# Altium project bailey.PrjPcb (part 3 of 11)
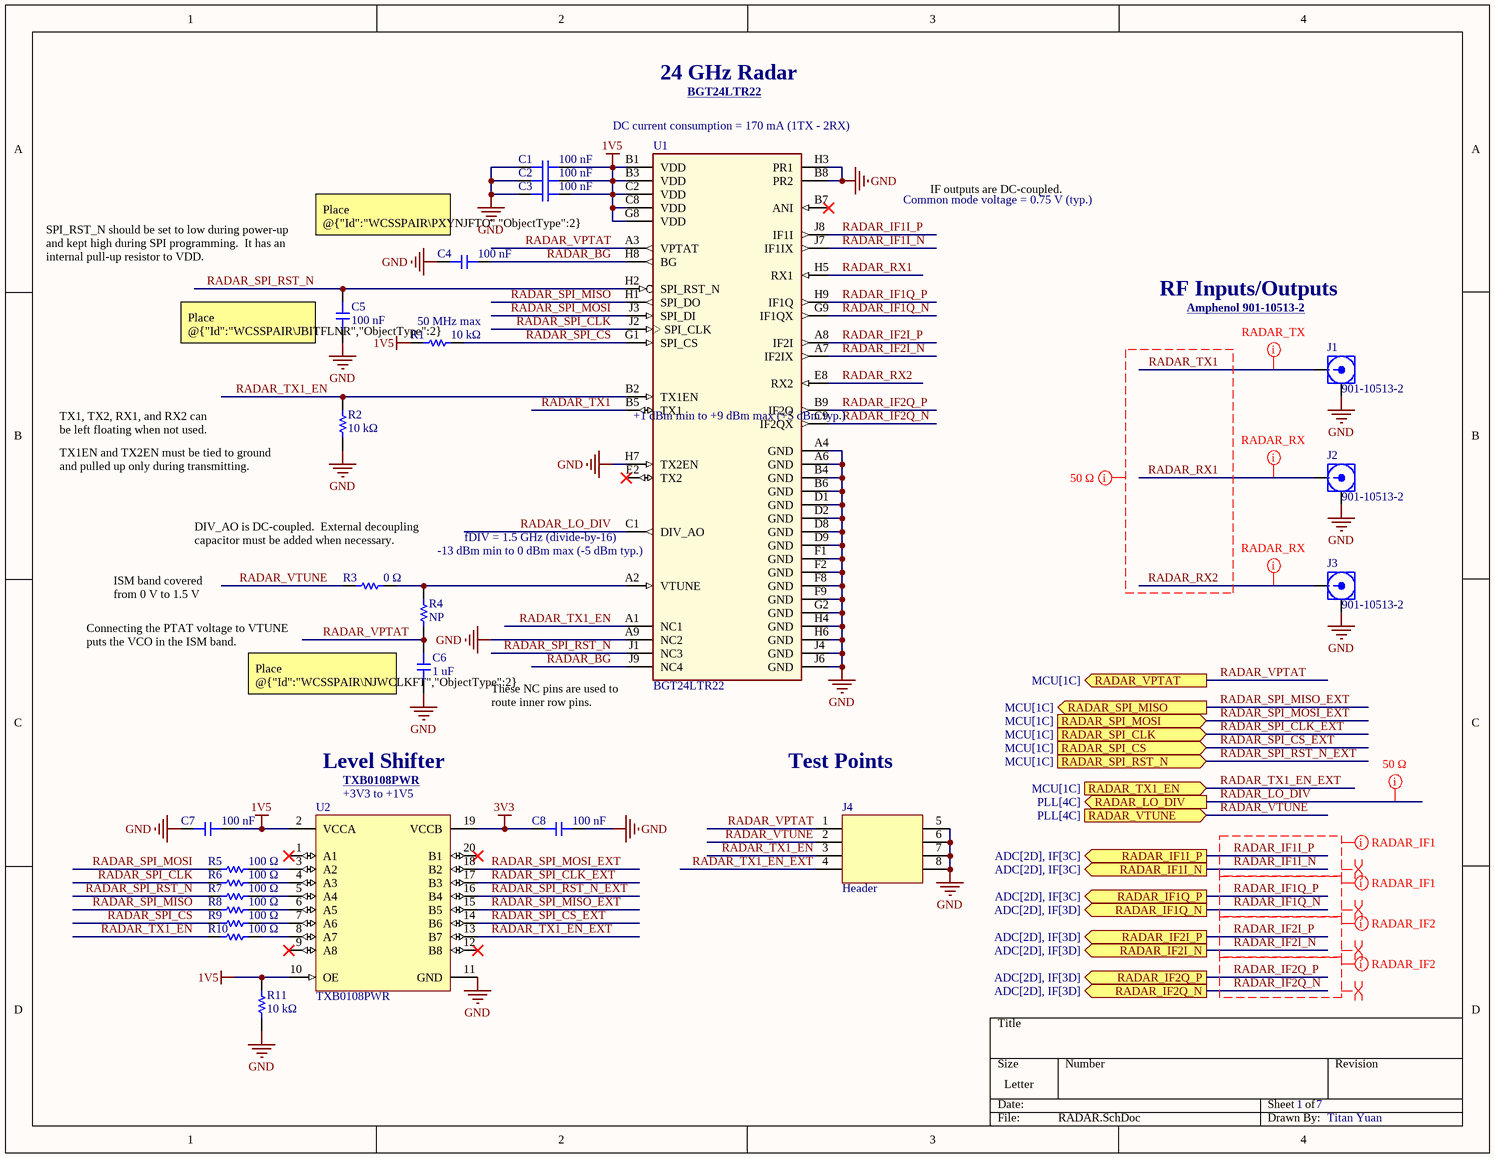
[diagram p8: RADAR.SchDoc]

## Sheet RADAR.SchDoc (continued)

### Library data of the parts (continued)
U2 = TXB0108PWR: 8-Bit Bidirectional Voltage-Level Shifter with Auto Direction Sensing and +/-15-kV ESD Protect 20-TSSOP -40 to 85; Manufacturer: Texas Instruments; Manufacturer Lifecycle Status: ACTIVE; Manufacturer Package Identifier: PW (R-PDSO-G**); Data Rate: 100Mbps; High Level Output Current: -20µA; Logic Function: Translator; Low Level Output Current: 20µA; Max Supply Voltage: 5.5V; Min Supply Voltage: 1.65V; Number of Bits: 8; Propagation Delay: 4ns; Quiescent Current: 3.5µA; Rise Time: 7.3ns; Topology: Push-Pull; Turn-On Delay Time: 9.5ns; Manufacturer Part Number: TXB0108PWR; Supplier: DigiKey; Supplier Part Number: 296-21527-1-ND; RoHS: Compliant; Category: Voltage Level Shifters; Stock: 22043; Pricing: 1=1.82, 10=1.338, 25=1.2176, 100=1.0851, 250=1.02184, 500=1.01132 (USD); Case/Package: TSSOP; Contact Plating: Gold; Height: 0m; Lead Free: Lead Free; Length: 6.5mm; Lifecycle Status: Production; Max Operating Temperature: 85°C; Min Operating Temperature: -40°C; Mounting Technology: Surface Mount; Number of Channels: 8; Number of Inputs: 8; Pins: 20; Output Current: 20µA; Radiation Hardening: No; REACH SVHC: No; Schedule B: 8542390000, 8542390000|8542390000|8542390000|8542390000|8542390000; Termination: SMD/SMT; Thickness: 1mm; Weight: 76.997305mg; Width: 4.4mm; ComponentLink1URL: https://sigma.octopart.com:443/157851284/technical_drawing/Texas-Instruments-TXB0108PWR.pdf?src-supplier=Texas+Instruments; ComponentLink1Description: https://sigma.octopart.com:443/157851284/technical_drawing/Texas-Instruments-TXB0108PWR.pdf?src-supplier=Texas+Instruments; ComponentLink2URL: https://octopart.com:443/opatz8j6/c1?t=LySuUYxN9QFMmqSZ0iSTBK1M-CfND3iA45F57-rgipnbsICCknTkoBhUukg2AkZDEL0aXzWd55iRogxa7qKL4TXUNFi6ipSyGXAAa9LZBdmP_Kv4vGBHh0qj-vgKaBFsF-d5KwYEI23cSnz-pp69Sgcy-_vsa0CB7mKhHXjctGx33TVX4QZBqIYpXxZkCgRNByv7fiJueXud0UX45YityO0p_-WYUGRJV_eJOGa4Ay7QQ8FZc3uEUNlVrkxXjQZMNFnbfnrSKCgesFBqhoNiKT25AC3yNUdmgJ7FLN5_z4zOzP0RR75DYkH4GMBnBzaYVRF7L7HNXVjS4Tp9-MFjD_sEQ-aCybQglHE52PnZL4JsgTDjFwelFwDtaMk_UKSdWjy_&src-supplier=Texas+Instruments; ComponentLink2Description: https://octopart.com:443/opatz8j6/c1?t=LySuUYxN9QFMmqSZ0iSTBK1M-CfND3iA45F57-rgipnbsICCknTkoBhUukg2AkZDEL0aXzWd55iRogxa7qKL4TXUNFi6ipSyGXAAa9LZBdmP_Kv4vGBHh0qj-vgKaBFsF-d5KwYEI23cSnz-pp69Sgcy-_vsa0CB7mKhHXjctGx33TVX4QZBqIYpXxZkCgRNByv7fiJueXud0UX45YityO0p_-WYUGRJV_eJOGa4Ay7QQ8FZc3uEUNlVrkxXjQZMNFnbfnrSKCgesFBqhoNiKT25AC3yNUdmgJ7FLN5_z4zOzP0RR75DYkH4GMBnBzaYVRF7L7HNXVjS4Tp9-MFjD_sEQ-aCybQglHE52PnZL4JsgTDjFwelFwDtaMk_UKSdWjy_&src-supplier=Texas+Instruments; ComponentLink3URL: https://datasheet.octopart.com:443/TXB0108PWR-Texas-Instruments-datasheet-34148259.pdf?src-supplier=Texas+Instruments; ComponentLink3Description: https://datasheet.octopart.com:443/TXB0108PWR-Texas-Instruments-datasheet-34148259.pdf?src-supplier=Texas+Instruments; ComponentLink4URL: https://datasheet.octopart.com:443/TXB0108PWR-Texas-Instruments-datasheet-11474939.pdf?src-supplier=Texas+Instruments; ComponentLink4Description: https://datasheet.octopart.com:443/TXB0108PWR-Texas-Instruments-datasheet-11474939.pdf?src-supplier=Texas+Instruments; ComponentLink5URL: https://datasheet.octopart.com:443/TXB0108PWR-Texas-Instruments-datasheet-10384694.pdf?src-supplier=Texas+Instruments; ComponentLink5Description: https://datasheet.octopart.com:443/TXB0108PWR-Texas-Instruments-datasheet-10384694.pdf?src-supplier=Texas+Instruments; ComponentLink6URL: https://datasheet.octopart.com:443/TXB0108PWR-Texas-Instruments-datasheet-10258393.pdf?src-supplier=Texas+Instruments; ComponentLink6Description: https://datasheet.octopart.com:443/TXB0108PWR-Texas-Instruments-datasheet-10258393.pdf?src-supplier=Texas+Instruments; ComponentLink7URL: https://sigma.octopart.com:443/49249835/technical_drawing/Texas-Instruments-TXB0108PWR.pdf?src-supplier=Texas+Instruments; ComponentLink7Description: https://sigma.octopart.com:443/49249835/technical_drawing/Texas-Instruments-TXB0108PWR.pdf?src-supplier=Texas+Instruments; ComponentLink8URL: https://datasheet.octopart.com:443/TXB0108PWR-Texas-Instruments-datasheet-37744618.pdf?src-supplier=Farnell; ComponentLink8Description: https://datasheet.octopart.com:443/TXB0108PWR-Texas-Instruments-datasheet-37744618.pdf?src-supplier=Farnell; ComponentLink9URL: https://datasheet.octopart.com:443/TXB0108PWR-Texas-Instruments-datasheet-8559414.pdf?src-supplier=Farnell; ComponentLink9Description: https://datasheet.octopart.com:443/TXB0108PWR-Texas-Instruments-datasheet-8559414.pdf?src-supplier=Farnell; ComponentLink10URL: https://datasheet.octopart.com:443/TXB0108PWR-Texas-Instruments-datasheet-5368061.pdf?src-supplier=Farnell; ComponentLink10Description: https://datasheet.octopart.com:443/TXB0108PWR-Texas-Instruments-datasheet-5368061.pdf?src-supplier=Farnell; ComponentLink11URL: https://datasheet.octopart.com:443/TXB0108PWR-Texas-Instruments-datasheet-66618004.pdf?src-supplier=Farnell; ComponentLink11Description: https://datasheet.octopart.com:443/TXB0108PWR-Texas-Instruments-datasheet-66618004.pdf?src-supplier=Farnell; ComponentLink12URL: https://datasheet.octopart.com:443/TXB0108PWR-Texas-Instruments-datasheet-48033010.pdf?src-supplier=Farnell; ComponentLink12Description: https://datasheet.octopart.com:443/TXB0108PWR-Texas-Instruments-datasheet-48033010.pdf?src-supplier=Farnell; ComponentLink13URL: https://datasheet.octopart.com:443/TXB0108PWR-Texas-Instruments-datasheet-10542789.pdf?src-supplier=Farnell; ComponentLink13Description: https://datasheet.octopart.com:443/TXB0108PWR-Texas-Instruments-datasheet-10542789.pdf?src-supplier=Farnell; ComponentLink14URL: https://datasheet.octopart.com:443/TXB0108PWR-Texas-Instruments-datasheet-151942.pdf?src-supplier=Upverter; ComponentLink14Description: https://datasheet.octopart.com:443/TXB0108PWR-Texas-Instruments-datasheet-151942.pdf?src-supplier=Upverter; ComponentLink15URL: https://datasheet.octopart.com:443/TXB0108PWR-Texas-Instruments-datasheet-11536343.pdf?src-supplier=Upverter; ComponentLink15Description: https://datasheet.octopart.com:443/TXB0108PWR-Texas-Instruments-datasheet-11536343.pdf?src-supplier=Upverter; ComponentLink16URL: https://datasheet.octopart.com:443/TXB0108PWR-Texas-Instruments-datasheet-33012939.pdf?src-supplier=element14+APAC; ComponentLink16Description: https://datasheet.octopart.com:443/TXB0108PWR-Texas-Instruments-datasheet-33012939.pdf?src-supplier=element14+APAC; ComponentLink17URL: https://datasheet.octopart.com:443/TXB0108PWR-Texas-Instruments-datasheet-165804950.pdf?src-supplier=LCSC; ComponentLink17Description: https://datasheet.octopart.com:443/TXB0108PWR-Texas-Instruments-datasheet-165804950.pdf?src-supplier=LCSC; ComponentLink18URL: https://datasheet.octopart.com:443/TXB0108PWR-Texas-Instruments-datasheet-159118386.pdf?src-supplier=LCSC; ComponentLink18Description: https://datasheet.octopart.com:443/TXB0108PWR-Texas-Instruments-datasheet-159118386.pdf?src-supplier=LCSC; ComponentLink19URL: https://datasheet.octopart.com:443/TXB0108PWR-Texas-Instruments-datasheet-137316104.pdf?src-supplier=Future+Electronics; ComponentLink19Description: https://datasheet.octopart.com:443/TXB0108PWR-Texas-Instruments-datasheet-137316104.pdf?src-supplier=Future+Electronics; ComponentLink20URL: https://datasheet.octopart.com:443/TXB0108PWR-Texas-Instruments-datasheet-14151550.pdf?src-supplier=iiiC; ComponentLink20Description: https://datasheet.octopart.com:443/TXB0108PWR-Texas-Instruments-datasheet-14151550.pdf?src-supplier=iiiC; ComponentLink21URL: https://datasheet.octopart.com:443/TXB0108PWR-Texas-Instruments-datasheet-126938.pdf?src-supplier=DigiKey; ComponentLink21Description: https://datasheet.octopart.com:443/TXB0108PWR-Texas-Instruments-datasheet-126938.pdf?src-supplier=DigiKey; ComponentLink22URL: http://sigma.octopart.com:80/reach_statement/Texas-Instruments-company-64.pdf?src-supplier=Compliance+Statements; ComponentLink22Description: http://sigma.octopart.com:80/reach_statement/Texas-Instruments-company-64.pdf?src-supplier=Compliance+Statements; ComponentLink23URL: http://sigma.octopart.com:80/conflict_mineral_statement/Texas-Instruments-company-63.pdf?src-supplier=Compliance+Statements; ComponentLink23Description: http://sigma.octopart.com:80/conflict_mineral_statement/Texas-Instruments-company-63.pdf?src-supplier=Compliance+Statements

## Sheet IF.SchDoc
size Letter; DrawnBy: Titan Yuan; DocumentNumber: 2; SheetNumber: 2; SheetTotal: 7
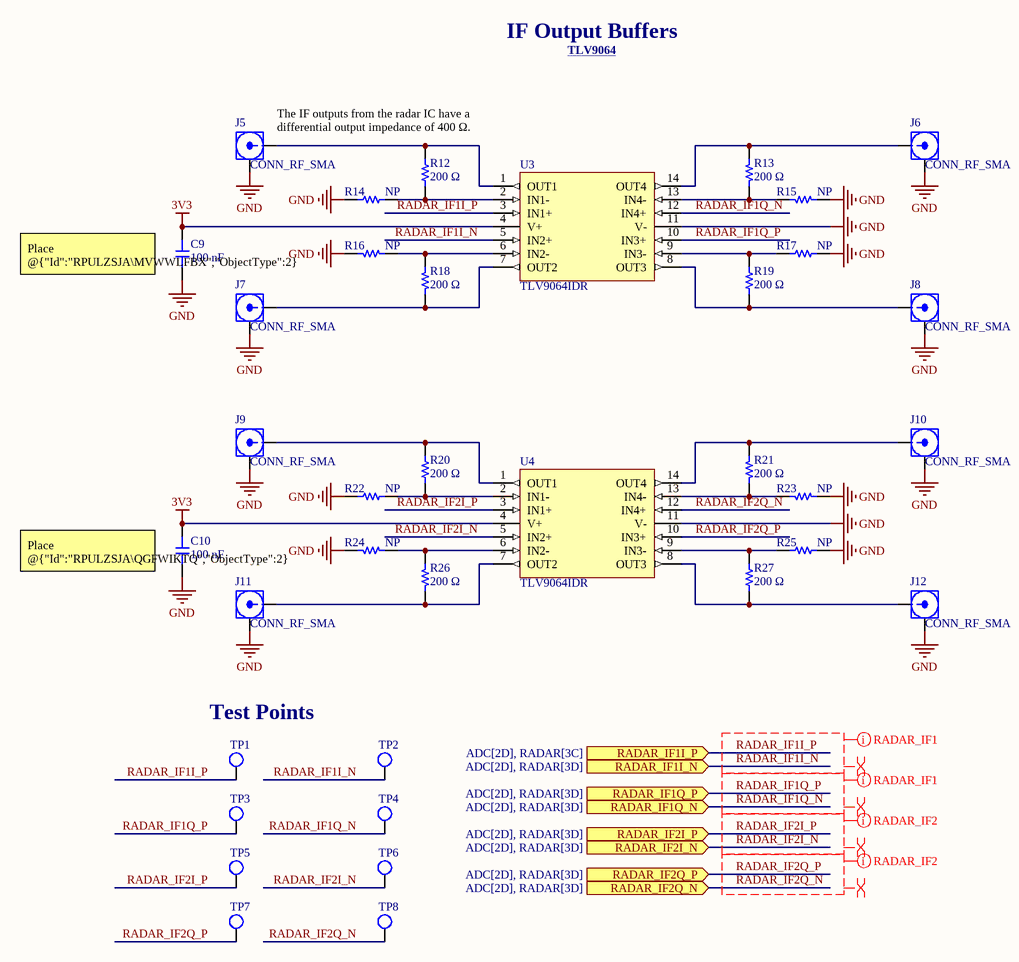
[diagram p1: IF.SchDoc]

### Parts
C9  100 nF  [CAP_0402]
C10  100 nF  [CAP_0402]
J5  CONN_RF_SMA  [SMA-J-P-H-ST-TH1]
J6  CONN_RF_SMA  [SMA-J-P-H-ST-TH1]
J7  CONN_RF_SMA  [SMA-J-P-H-ST-TH1]
J8  CONN_RF_SMA  [SMA-J-P-H-ST-TH1]
J9  CONN_RF_SMA  [SMA-J-P-H-ST-TH1]
J10  CONN_RF_SMA  [SMA-J-P-H-ST-TH1]
J11  CONN_RF_SMA  [SMA-J-P-H-ST-TH1]
J12  CONN_RF_SMA  [SMA-J-P-H-ST-TH1]
R12  200 Ω  [RES_0603]
R13  200 Ω  [RES_0603]
R14  NP  [RES_0603]
R15  NP  [RES_0603]
R16  NP  [RES_0603]
R17  NP  [RES_0603]
R18  200 Ω  [RES_0603]
R19  200 Ω  [RES_0603]
R20  200 Ω  [RES_0603]
R21  200 Ω  [RES_0603]
R22  NP  [RES_0603]
R23  NP  [RES_0603]
R24  NP  [RES_0603]
R25  NP  [RES_0603]
R26  200 Ω  [RES_0603]
R27  200 Ω  [RES_0603]
TP1  TEST_POINT  [TEST_POINT]  (value not drawn)
TP2  TEST_POINT  [TEST_POINT]  (value not drawn)
TP3  TEST_POINT  [TEST_POINT]  (value not drawn)
TP4  TEST_POINT  [TEST_POINT]  (value not drawn)
TP5  TEST_POINT  [TEST_POINT]  (value not drawn)
TP6  TEST_POINT  [TEST_POINT]  (value not drawn)
TP7  TEST_POINT  [TEST_POINT]  (value not drawn)
TP8  TEST_POINT  [TEST_POINT]  (value not drawn)
U3  TLV9064IDR  [TLV9064IDR]
U4  TLV9064IDR  [TLV9064IDR]

### Ports
RADAR_IF1I_N (in, see ADC[2D], RADAR[3D]), RADAR_IF1I_P (in, see ADC[2D], RADAR[3C]), RADAR_IF1Q_N (in, see ADC[2D], RADAR[3D]), RADAR_IF1Q_P (in, see ADC[2D], RADAR[3D]), RADAR_IF2I_N (in, see ADC[2D], RADAR[3D]), RADAR_IF2I_P (in, see ADC[2D], RADAR[3D]), RADAR_IF2Q_N (in, see ADC[2D], RADAR[3D]), RADAR_IF2Q_P (in, see ADC[2D], RADAR[3D])

### Nets
3V3: C9.1 C10.1 U3.4(V+) U4.4(V+)  [project net AVDD]
GND: C9.2 C10.2 J5.2 J6.2 J7.2 J8.2 J9.2 J10.2 J11.2 J12.2 R14.2 R15.2 R16.2 R17.2 R22.2 R23.2 R24.2 R25.2 U3.11(V-) U4.11(V-)
RADAR_IF1I_N: TP2.1 U3.5(IN2+) ; port RADAR_IF1I_N
RADAR_IF1I_P: TP1.1 U3.3(IN1+) ; port RADAR_IF1I_P
RADAR_IF1Q_N: TP4.1 U3.12(IN4+) ; port RADAR_IF1Q_N
RADAR_IF1Q_P: TP3.1 U3.10(IN3+) ; port RADAR_IF1Q_P
RADAR_IF2I_N: TP6.1 U4.5(IN2+) ; port RADAR_IF2I_N
RADAR_IF2I_P: TP5.1 U4.3(IN1+) ; port RADAR_IF2I_P
RADAR_IF2Q_N: TP8.1 U4.12(IN4+) ; port RADAR_IF2Q_N
RADAR_IF2Q_P: TP7.1 U4.10(IN3+) ; port RADAR_IF2Q_P
NetJ5_1: J5.1 R12.2 U3.1(OUT1)
NetJ6_1: J6.1 R13.2 U3.14(OUT4)
NetJ7_1: J7.1 R18.2 U3.7(OUT2)
NetJ8_1: J8.1 R19.2 U3.8(OUT3)
NetJ9_1: J9.1 R20.2 U4.1(OUT1)
NetJ10_1: J10.1 R21.2 U4.14(OUT4)
NetJ11_1: J11.1 R26.2 U4.7(OUT2)
NetJ12_1: J12.1 R27.2 U4.8(OUT3)
NetR12_1: R12.1 R14.1 U3.2(IN1-)
NetR13_1: R13.1 R15.1 U3.13(IN4-)
NetR16_1: R16.1 R18.1 U3.6(IN2-)
NetR17_1: R17.1 R19.1 U3.9(IN3-)
NetR20_1: R20.1 R22.1 U4.2(IN1-)
NetR21_1: R21.1 R23.1 U4.13(IN4-)
NetR24_1: R24.1 R26.1 U4.6(IN2-)
NetR25_1: R25.1 R27.1 U4.9(IN3-)

### Layout directives
differential pair: RADAR_IF1I_N, RADAR_IF1I_P, RADAR_IF1Q_N, RADAR_IF1Q_P, RADAR_IF2I_N, RADAR_IF2I_P, RADAR_IF2Q_N, RADAR_IF2Q_P
mark named RADAR_IF1: RADAR_IF1I_N, RADAR_IF1I_P, RADAR_IF1Q_N, RADAR_IF1Q_P
mark named RADAR_IF2: RADAR_IF2I_N, RADAR_IF2I_P, RADAR_IF2Q_N, RADAR_IF2Q_P

### Notes on the sheet
- IF Output Buffers
- TLV9064 <https://www.ti.com/product/TLV9064>
- The IF outputs from the radar IC have a differential output impedance of 400 Ω.
- (near C9) Place @{"Id":"RPULZSJA\MVWWLFBX","ObjectType":2} as close to the device as possible.
- (near C10) Place @{"Id":"RPULZSJA\QGFWIKTQ","ObjectType":2} as close to the device as possible.
- (near TP1) Test Points

### Library data of the parts
C9 C10 = CAP: 25V 100nF X7R ±10% 0402 Multilayer Ceramic Capacitors MLCC - SMD/SMT ROHS; Manufacturer: Samsung Electro-Mechanics; Manufacturer Part Number: CL05B104KA5NNNC; Tolerance: 10%; Voltage Rating: 25 V; Dielectric: Ceramic; Package Size: 0402; Supplier: DigiKey; Supplier Part Number: 1276-6720-1-ND; RoHS: Compliant; Category: Ceramic Capacitors; Stock: 5149468; Pricing: 1=0.08, 10=0.002 (USD); Value: 100nF; Case/Package: 0402; Case Code (Imperial): 0402; Case Code (Metric): 1005; China RoHS: Compliant; Country of Origin: Mainland China, Philippines, South Korea; Dielectric Material: Ceramic; Export Control Classification Number (ECCN) Code: EAR99; Height: 500µm; Harmonized Tariff Schedule (HTS) Code: 8532.24.00.20; Introduction Date: 2009-10-27; Length: 1mm; Lifecycle Status: Production; Material: Ceramic; Max Operating Temperature: 125°C; Min Operating Temperature: -55°C; Mounting Technology: Surface Mount; Number of Terminals: 2; REACH SVHC: Yes; Schedule B: 8532240020, 8532240020|8532240020|8532240020|8532240020|8532240020|8532240020|8532240020|8532240020|8532240020|8532240020|8532240020|8532240020|8532240020|8532240020|8532240020|8532240020|8532240020|8532240020|8532240020|8532240020|8532240020|8532240020|8532240020|85; Thickness: 558.8µm; Voltage Rating (DC): 25V; Width: 500µm; ComponentLink1URL: https://datasheet.octopart.com:443/CL05B104KA5NNNC-Samsung-Electro-Mechanics-datasheet-136876160.pdf?src-supplier=Samsung+SCT; ComponentLink1Description: https://datasheet.octopart.com:443/CL05B104KA5NNNC-Samsung-Electro-Mechanics-datasheet-136876160.pdf?src-supplier=Samsung+SCT; ComponentLink2URL: https://datasheet.octopart.com:443/CL05B104KA5NNNC-Samsung-Electro-Mechanics-datasheet-116890910.pdf?src-supplier=Future+Electronics; ComponentLink2Description: https://datasheet.octopart.com:443/CL05B104KA5NNNC-Samsung-Electro-Mechanics-datasheet-116890910.pdf?src-supplier=Future+Electronics; ComponentLink3URL: https://datasheet.octopart.com:443/CL05B104KA5NNNC-Samsung-Electro-Mechanics-datasheet-104201047.pdf?src-supplier=Future+Electronics; ComponentLink3Description: https://datasheet.octopart.com:443/CL05B104KA5NNNC-Samsung-Electro-Mechanics-datasheet-104201047.pdf?src-supplier=Future+Electronics; ComponentLink4URL: https://datasheet.octopart.com:443/CL05B104KA5NNNC-Samsung-Electro-Mechanics-datasheet-148801811.pdf?src-supplier=Future+Electronics; ComponentLink4Description: https://datasheet.octopart.com:443/CL05B104KA5NNNC-Samsung-Electro-Mechanics-datasheet-148801811.pdf?src-supplier=Future+Electronics; ComponentLink5URL: https://datasheet.octopart.com/CL05B104KA5NNNC-Samsung-Electro-Mechanics-datasheet-97040617.pdf; ComponentLink5Description: https://datasheet.octopart.com/CL05B104KA5NNNC-Samsung-Electro-Mechanics-datasheet-97040617.pdf; ComponentLink6URL: https://datasheet.octopart.com/CL05B104KA5NNNC-Samsung-Electro-Mechanics-datasheet-8324245.pdf; ComponentLink6Description: https://datasheet.octopart.com/CL05B104KA5NNNC-Samsung-Electro-Mechanics-datasheet-8324245.pdf; ComponentLink7URL: https://datasheet.octopart.com/General-Multilayer-Ceramic-Capacitors-Samsung-datasheet-family-111.pdf; ComponentLink7Description: https://datasheet.octopart.com/General-Multilayer-Ceramic-Capacitors-Samsung-datasheet-family-111.pdf; ComponentLink8URL: https://datasheet.octopart.com:443/CL05B104KA5NNNC-Samsung-datasheet-8326407.pdf?src-supplier=TME; ComponentLink8Description: https://datasheet.octopart.com:443/CL05B104KA5NNNC-Samsung-datasheet-8326407.pdf?src-supplier=TME; ComponentLink9URL: http://sigma.octopart.com:80/rohs_certificate/General-Multilayer-Ceramic-Capacitors-Samsung-family-110.pdf?src-supplier=Compliance+Statements; ComponentLink9Description: http://sigma.octopart.com:80/rohs_certificate/General-Multilayer-Ceramic-Capacitors-Samsung-family-110.pdf?src-supplier=Compliance+Statements; ComponentLink10URL: http://sigma.octopart.com:80/rohs_statement/General-Multilayer-Ceramic-Capacitors-Samsung-family-132.pdf?src-supplier=Compliance+Statements; ComponentLink10Description: http://sigma.octopart.com:80/rohs_statement/General-Multilayer-Ceramic-Capacitors-Samsung-family-132.pdf?src-supplier=Compliance+Statements; ComponentLink11URL: http://sigma.octopart.com:80/reach_statement/General-Multilayer-Ceramic-Capacitors-Samsung-family-133.pdf?src-supplier=Compliance+Statements; ComponentLink11Description: http://sigma.octopart.com:80/reach_statement/General-Multilayer-Ceramic-Capacitors-Samsung-family-133.pdf?src-supplier=Compliance+Statements
J5-J12 = CONN_RF_SMA: RF / Coaxial Connector, SMA Coaxial, Straight Jack, Through Hole Vertical, 50 ohm; Manufacturer: Samtec; Manufacturer Lifecycle Status: PRODUCTION; Maximum Frequency: 20 GHz; Body Material: Brass; Body Plating: Gold; Connector Type: SMA, Socket; Dielectric Material: PTFE; Frequency: 20GHz; Gender: Female; Impedance: 50Ω; Clock Frequency: 6GHz; Number of Contacts: 1; Voltage Rating: 335V; Manufacturer Part Number: SMA-J-P-H-ST-TH1; Supplier: DigiKey; Supplier Part Number: SAM8971-ND; RoHS: Compliant; Category: RF / Coaxial Connectors; Stock: 25259; Pricing: 1=2.75, 10=2.333, 25=2.1864, 50=2.0818, 100=1.9823, 250=1.85816, 500=1.76948, 1000=1.68505, 2500=1.584 (USD); Case/Package: SMA; Contact Material: Gold; Contact Plating: Gold; Depth: 7mm; Fastening Type: Threaded; Height: 9.81mm; Housing Color: Gold; Insulation Material: Polytetrafluoroethylene; Length: 7mm; Lifecycle Status: Production; Max Operating Temperature: 125°C; Min Operating Temperature: -65°C; Mounting Technology: Flanges, Panel, Through Hole; Orientation: Straight; Radiation Hardening: No; Termination: Solder; ComponentLink1URL: https://datasheet.octopart.com:443/SMA-J-P-H-ST-TH1-Samtec-datasheet-104427088.pdf?src-supplier=Upverter; ComponentLink1Description: https://datasheet.octopart.com:443/SMA-J-P-H-ST-TH1-Samtec-datasheet-104427088.pdf?src-supplier=Upverter; ComponentLink2URL: https://sigma.octopart.com:443/97281565/technical_drawing/Samtec-SMA-J-P-H-ST-TH1.pdf?src-supplier=Upverter; ComponentLink2Description: https://sigma.octopart.com:443/97281565/technical_drawing/Samtec-SMA-J-P-H-ST-TH1.pdf?src-supplier=Upverter; ComponentLink3URL: https://datasheet.octopart.com:443/SMA-J-P-H-ST-TH1-Samtec-datasheet-97281556.pdf?src-supplier=Electro+Sonic; ComponentLink3Description: https://datasheet.octopart.com:443/SMA-J-P-H-ST-TH1-Samtec-datasheet-97281556.pdf?src-supplier=Electro+Sonic; ComponentLink4URL: https://datasheet.octopart.com:443/SMA-J-P-H-ST-TH1-Samtec-datasheet-157420883.pdf?src-supplier=Newark; ComponentLink4Description: https://datasheet.octopart.com:443/SMA-J-P-H-ST-TH1-Samtec-datasheet-157420883.pdf?src-supplier=Newark; ComponentLink5URL: https://datasheet.octopart.com:443/SMA-J-P-H-ST-TH1-Samtec-datasheet-180264035.pdf?src-supplier=JRH+Electronics; ComponentLink5Description: https://datasheet.octopart.com:443/SMA-J-P-H-ST-TH1-Samtec-datasheet-180264035.pdf?src-supplier=JRH+Electronics; ComponentLink6URL: https://datasheet.octopart.com:443/SMA-J-P-H-ST-TH1-Samtec-datasheet-159753816.pdf?src-supplier=Toby+Electronics; ComponentLink6Description: https://datasheet.octopart.com:443/SMA-J-P-H-ST-TH1-Samtec-datasheet-159753816.pdf?src-supplier=Toby+Electronics; ComponentLink7URL: https://datasheet.octopart.com:443/SMA-J-P-H-ST-TH1-Samtec-datasheet-116536392.pdf?src-supplier=Toby+Electronics; ComponentLink7Description: https://datasheet.octopart.com:443/SMA-J-P-H-ST-TH1-Samtec-datasheet-116536392.pdf?src-supplier=Toby+Electronics; ComponentLink8URL: https://datasheet.octopart.com:443/SMA-J-P-H-ST-TH1-Samtec-datasheet-116536236.pdf?src-supplier=Toby+Electronics; ComponentLink8Description: https://datasheet.octopart.com:443/SMA-J-P-H-ST-TH1-Samtec-datasheet-116536236.pdf?src-supplier=Toby+Electronics
R12 R13 R18-R21 R26 R27 = RES: 100mW Thick Film Resistors 75V ±100ppm/℃ ±1% 200Ω 0603 Chip Resistor - Surface Mount ROHS; Manufacturer: Yageo; Manufacturer Part Number: RC0603FR-07200RL; Manufacturer Lifecycle Status: ACTIVE; Part Series: Thin Film Chip Resistors, High Reliability Type; Temperature Coefficient: 25ppm/°C; Tolerance: 1%; Package Size: 0603; Supplier: DigiKey; Supplier Part Number: P200DBCT-ND; RoHS: Compliant; Category: Chip SMD Resistors; Stock: 33785; Pricing: 1=0.1, 10=0.061, 25=0.0568, 50=0.0536, 100=0.0506, 250=0.04692, 500=0.04438, 1000=0.04206 (USD); Case/Package: 0603; Case Code (Imperial): 0603; Composition: Thin Film; Contact Plating: Tin; Country of Origin: Japan; Depth: 800µm; Export Control Classification Number (ECCN) Code: EAR99; Features: Automotive AEC-Q200; Height: 450µm; Harmonized Tariff Schedule (HTS) Code: 8533.21.00.30; Introduction Date: 2008-03-19; Lead Free: Lead Free; Length: 1.6mm; Lifecycle Status: Production; Max Operating Temperature: 155°C; Max Power Dissipation: 100mW; Military Standard: Not; Min Operating Temperature: -55°C; Mounting Technology: Surface Mount; Pins: 2; Number of Terminals: 2; Number of Terminations: 2; Packaging: Cut Tape; Power Dissipation: 100mW; Power Rating: 100mW; Radiation Hardening: No; REACH SVHC: Yes; Value: 200Ω; Schedule B: 8533210045, 8533210045|8533210045, 8533210045|8533210045|8533210045, 8533210045|8533210045|8533210045|8533210045|8533210045|8533210045|8533210045|8533210045|8533210045|8533210045|8533210045|8533210045|8533210045|8533210045|8533210045|8533210045|8533210045|8533210045|8533210045|8533210045|8533210045|8533210045|8533210045|85; Termination: SMD/SMT; Voltage Rating (DC): 75V; Width: 800µm; Working Voltage: 75V; ComponentLink1URL: https://datasheet.octopart.com:443/ERA-3AEB201V-Panasonic-datasheet-62287448.pdf?src-supplier=Newark; ComponentLink1Description: https://datasheet.octopart.com:443/ERA-3AEB201V-Panasonic-datasheet-62287448.pdf?src-supplier=Newark; ComponentLink2URL: https://datasheet.octopart.com:443/ERA-3AEB201V-Panasonic-datasheet-136531316.pdf?src-supplier=Newark; ComponentLink2Description: https://datasheet.octopart.com:443/ERA-3AEB201V-Panasonic-datasheet-136531316.pdf?src-supplier=Newark; ComponentLink3URL: https://datasheet.octopart.com:443/ERA-3AEB201V-Panasonic-datasheet-8367715.pdf?src-supplier=element14+APAC; ComponentLink3Description: https://datasheet.octopart.com:443/ERA-3AEB201V-Panasonic-datasheet-8367715.pdf?src-supplier=element14+APAC; ComponentLink4URL: https://datasheet.octopart.com:443/ERA-3AEB201V-Panasonic-datasheet-61114971.pdf?src-supplier=element14+APAC; ComponentLink4Description: https://datasheet.octopart.com:443/ERA-3AEB201V-Panasonic-datasheet-61114971.pdf?src-supplier=element14+APAC; ComponentLink5URL: https://datasheet.octopart.com:443/ERA-3AEB201V-Panasonic-datasheet-13266200.pdf?src-supplier=_legacy+Avnet; ComponentLink5Description: https://datasheet.octopart.com:443/ERA-3AEB201V-Panasonic-datasheet-13266200.pdf?src-supplier=_legacy+Avnet; ComponentLink6URL: https://datasheet.octopart.com:443/ERA-3AEB201V-Panasonic-datasheet-118567.pdf?src-supplier=element14; ComponentLink6Description: https://datasheet.octopart.com:443/ERA-3AEB201V-Panasonic-datasheet-118567.pdf?src-supplier=element14; ComponentLink7URL: https://datasheet.octopart.com:443/ERA-3AEB201V-Panasonic-datasheet-154766165.pdf?src-supplier=Master+Electronics; ComponentLink7Description: https://datasheet.octopart.com:443/ERA-3AEB201V-Panasonic-datasheet-154766165.pdf?src-supplier=Master+Electronics; ComponentLink8URL: https://datasheet.octopart.com:443/ERA-3AEB201V-Panasonic-datasheet-12510007.pdf?src-supplier=Future+Electronics; ComponentLink8Description: https://datasheet.octopart.com:443/ERA-3AEB201V-Panasonic-datasheet-12510007.pdf?src-supplier=Future+Electronics; ComponentLink9URL: https://datasheet.octopart.com:443/ERA-3AEB201V-Panasonic-datasheet-11763931.pdf?src-supplier=Future+Electronics; ComponentLink9Description: https://datasheet.octopart.com:443/ERA-3AEB201V-Panasonic-datasheet-11763931.pdf?src-supplier=Future+Electronics; ComponentLink10URL: https://datasheet.octopart.com:443/ERA-3AEB201V-Panasonic-datasheet-10840895.pdf?src-supplier=Future+Electronics; ComponentLink10Description: https://datasheet.octopart.com:443/ERA-3AEB201V-Panasonic-datasheet-10840895.pdf?src-supplier=Future+Electronics; ComponentLink11URL: https://datasheet.octopart.com:443/ERA-3AEB201V-Panasonic-datasheet-5392808.pdf?src-supplier=Future+Electronics; ComponentLink11Description: https://datasheet.octopart.com:443/ERA-3AEB201V-Panasonic-datasheet-5392808.pdf?src-supplier=Future+Electronics; ComponentLink12URL: https://datasheet.octopart.com:443/ERA-3AEB201V-Panasonic-datasheet-46744048.pdf?src-supplier=RS+(Formerly+Allied+Electronics); ComponentLink12Description: https://datasheet.octopart.com:443/ERA-3AEB201V-Panasonic-datasheet-46744048.pdf?src-supplier=RS+(Formerly+Allied+Electronics); ComponentLink13URL: https://datasheet.octopart.com:443/ERA3AEB201V-Panasonic-datasheet-188913046.pdf?src-supplier=TME; ComponentLink13Description: https://datasheet.octopart.com:443/ERA3AEB201V-Panasonic-datasheet-188913046.pdf?src-supplier=TME; ComponentLink14URL: https://datasheet.octopart.com:443/ERA3AEB201V-Panasonic-datasheet-182736486.pdf?src-supplier=HQonline; ComponentLink14Description: https://datasheet.octopart.com:443/ERA3AEB201V-Panasonic-datasheet-182736486.pdf?src-supplier=HQonline; ComponentLink15URL: https://sigma.octopart.com:443/150570796/technical_drawing/Panasonic-ERA3AEB201V.pdf?src-supplier=Panasonic+SCT; ComponentLink15Description: https://sigma.octopart.com:443/150570796/technical_drawing/Panasonic-ERA3AEB201V.pdf?src-supplier=Panasonic+SCT; ComponentLink16URL: https://datasheet.octopart.com:443/ERA3AEB201V-Panasonic-datasheet-138783076.pdf?src-supplier=Burklin+Elektronik; ComponentLink16Description: https://datasheet.octopart.com:443/ERA3AEB201V-Panasonic-datasheet-138783076.pdf?src-supplier=Burklin+Elektronik; ComponentLink17URL: https://datasheet.octopart.com/ERA-3AEB201V-Panasonic-datasheet-78375410.pdf; ComponentLink17Description: https://datasheet.octopart.com/ERA-3AEB201V-Panasonic-datasheet-78375410.pdf; ComponentLink18URL: https://datasheet.octopart.com:443/ERA3AEB201V-Panasonic---ECG-datasheet-15994758.pdf?src-supplier=Farnell; ComponentLink18Description: https://datasheet.octopart.com:443/ERA3AEB201V-Panasonic---ECG-datasheet-15994758.pdf?src-supplier=Farnell; ComponentLink19URL: https://datasheet.octopart.com:443/ERA3AEB201V-Panasonic-datasheet-10050158.pdf?src-supplier=Arrow+Electronics; ComponentLink19Description: https://datasheet.octopart.com:443/ERA3AEB201V-Panasonic-datasheet-10050158.pdf?src-supplier=Arrow+Electronics; ComponentLink20URL: https://datasheet.octopart.com:443/ERA-3AEB201V-Panasonic-datasheet-33006989.pdf?src-supplier=Electro+Sonic; ComponentLink20Description: https://datasheet.octopart.com:443/ERA-3AEB201V-Panasonic-datasheet-33006989.pdf?src-supplier=Electro+Sonic; China RoHS: Non-Compliant; ComponentLink21URL: https://datasheet.octopart.com:443/RC0603FR-07200RL-Yageo-datasheet-175887523.pdf?src-supplier=IHS; ComponentLink21Description: https://datasheet.octopart.com:443/RC0603FR-07200RL-Yageo-datasheet-175887523.pdf?src-supplier=IHS; ComponentLink22URL: https://datasheet.octopart.com:443/RC0603FR-07200RL-Yageo-datasheet-103092701.pdf?src-supplier=Upverter; ComponentLink22Description: https://datasheet.octopart.com:443/RC0603FR-07200RL-Yageo-datasheet-103092701.pdf?src-supplier=Upverter; ComponentLink23URL: https://datasheet.octopart.com:443/RC0603FR-07200RL-Yageo-datasheet-8328172.pdf?src-supplier=Farnell; ComponentLink23Description: https://datasheet.octopart.com:443/RC0603FR-07200RL-Yageo-datasheet-8328172.pdf?src-supplier=Farnell; ComponentLink24URL: https://datasheet.octopart.com:443/RC0603FR-07200RL-Yageo-datasheet-62067350.pdf?src-supplier=Farnell; ComponentLink24Description: https://datasheet.octopart.com:443/RC0603FR-07200RL-Yageo-datasheet-62067350.pdf?src-supplier=Farnell; ComponentLink25URL: https://datasheet.octopart.com:443/RC0603FR-07200RL-Yageo-datasheet-34211833.pdf?src-supplier=element14+APAC; ComponentLink25Description: https://datasheet.octopart.com:443/RC0603FR-07200RL-Yageo-datasheet-34211833.pdf?src-supplier=element14+APAC; ComponentLink26URL: https://datasheet.octopart.com:443/RC0603FR-07200RL-Yageo-Group-datasheet-176638170.pdf?src-supplier=Future+Electronics; ComponentLink26Description: https://datasheet.octopart.com:443/RC0603FR-07200RL-Yageo-Group-datasheet-176638170.pdf?src-supplier=Future+Electronics; ComponentLink27URL: https://datasheet.octopart.com:443/RC0603FR-07200RL-Yageo-datasheet-164759695.pdf?src-supplier=Future+Electronics; ComponentLink27Description: https://datasheet.octopart.com:443/RC0603FR-07200RL-Yageo-datasheet-164759695.pdf?src-supplier=Future+Electronics; ComponentLink28URL: https://datasheet.octopart.com:443/RC0603FR-07200RL-Yageo-datasheet-137700087.pdf?src-supplier=Future+Electronics; ComponentLink28Description: https://datasheet.octopart.com:443/RC0603FR-07200RL-Yageo-datasheet-137700087.pdf?src-supplier=Future+Electronics; ComponentLink29URL: https://datasheet.octopart.com:443/RC0603FR-07200RL-Yageo-datasheet-15599030.pdf?src-supplier=Future+Electronics; ComponentLink29Description: https://datasheet.octopart.com:443/RC0603FR-07200RL-Yageo-datasheet-15599030.pdf?src-supplier=Future+Electronics; ComponentLink30URL: https://datasheet.octopart.com:443/RC0603FR-07200RL-Yageo-datasheet-12596169.pdf?src-supplier=Future+Electronics; ComponentLink30Description: https://datasheet.octopart.com:443/RC0603FR-07200RL-Yageo-datasheet-12596169.pdf?src-supplier=Future+Electronics; ComponentLink31URL: https://datasheet.octopart.com:443/RC0603FR-07200RL-Yageo-datasheet-8324193.pdf?src-supplier=Future+Electronics; ComponentLink31Description: https://datasheet.octopart.com:443/RC0603FR-07200RL-Yageo-datasheet-8324193.pdf?src-supplier=Future+Electronics; ComponentLink32URL: https://datasheet.octopart.com:443/RC0603FR-07200RL-Yageo-datasheet-148775077.pdf?src-supplier=TME; ComponentLink32Description: https://datasheet.octopart.com:443/RC0603FR-07200RL-Yageo-datasheet-148775077.pdf?src-supplier=TME; ComponentLink33URL: https://datasheet.octopart.com:443/RC0603FR-07200RL-Yageo-datasheet-79472498.pdf?src-supplier=Megastar; ComponentLink33Description: https://datasheet.octopart.com:443/RC0603FR-07200RL-Yageo-datasheet-79472498.pdf?src-supplier=Megastar; ComponentLink34URL: https://datasheet.octopart.com/RC0603FR-07200RL-Yageo-datasheet-73766026.pdf; ComponentLink34Description: https://datasheet.octopart.com/RC0603FR-07200RL-Yageo-datasheet-73766026.pdf; ComponentLink35URL: https://datasheet.octopart.com:443/RC0603FR-07200RL-Yageo-datasheet-118562.pdf?src-supplier=DigiKey; ComponentLink35Description: https://datasheet.octopart.com:443/RC0603FR-07200RL-Yageo-datasheet-118562.pdf?src-supplier=DigiKey; ComponentLink36URL: http://sigma.octopart.com:80/conflict_mineral_statement/Yageo-company-3.pdf?src-supplier=Compliance+Statements; ComponentLink36Description: http://sigma.octopart.com:80/conflict_mineral_statement/Yageo-company-3.pdf?src-supplier=Compliance+Statements; ComponentLink37URL: http://sigma.octopart.com:80/rohs_statement/Yageo-company-2.pdf?src-supplier=Compliance+Statements; ComponentLink37Description: http://sigma.octopart.com:80/rohs_statement/Yageo-company-2.pdf?src-supplier=Compliance+Statements
R14-R17 R22-R25 = RES: Resistor SMD Generic; Manufacturer: *; Manufacturer Part Number: *; Tolerance: *; Package Size: 0603; Voltage Rating: *
TP1-TP8 = TEST_POINT: Test Point Generic
U3 U4 = TLV9064IDR: Quad, 5.5-V, 10-MHz, RRIO operational amplifier for cost-optimized applications 14-SOIC -40 to 125; Manufacturer: Texas Instruments; Manufacturer Lifecycle Status: ACTIVE; Bandwidth: 10MHz; Number of Channels: 4; Slew Rate: 6.5V/µs; Manufacturer Part Number: TLV9064IDR; Supplier: DigiKey; Supplier Part Number: 296-47549-1-ND; RoHS: Compliant; Category: Amplifiers - Op Amps, Buffer, Instrumentation; Stock: 4493; Pricing: 1=1.49, 10=1.085, 25=0.9844, 100=0.8739, 250=0.8212, 500=0.78944, 1000=0.76329 (USD); Case/Package: SOIC; Height: 0m; Length: 8.65mm; Lifecycle Status: Production; Max Operating Temperature: 125°C; Min Operating Temperature: -40°C; Pins: 14; Packaging: Cut Tape; Schedule B: 8542330000, 8542330000|8542330000|8542330000|8542330000|8542330000; Thickness: 1.58mm; Width: 3.91mm; ComponentLink1URL: https://sigma.octopart.com:443/182471030/technical_drawing/Texas-Instruments-TLV9064IDR.pdf?src-supplier=Texas+Instruments; ComponentLink1Description: https://sigma.octopart.com:443/182471030/technical_drawing/Texas-Instruments-TLV9064IDR.pdf?src-supplier=Texas+Instruments; ComponentLink2URL: https://octopart.com:443/opatz8j6/c1?t=b8RlzpfQG-h9uOWAabMAiPJWoCTgAwquZzec_BkdV6ZjMU2OI4YyppNX09BT2fM0gpcDMTQrYtgvce6_TtfmK4XZa-h4SQxM8TKEKMrJJktc7O_kAaPT_h62tC27hsW5hQAKMoGbKBjHibz2blvr-fhN1RVl1yW8EvD465A9BJDSrY_kRU3crDNophsG2nTX2Be3i9H2X4Kl0o-rARNMZYxgtWRCQAP9XVS_fu0jqO5PbtSNR57rXOk02X4GKKjnzDeVifR_OIS0uZ1j_pAkmvXspyYvhGUJvwUxZqgyekwRIScv7vrk5hgDM9rgOsgWHAf34DWgZgApfn4NaTTf5ebtlEHCtjJg6ABKjJ4CBoMZf9D-5muRZyk3ZTspSwA1lzBPrFk&src-supplier=Texas+Instruments; ComponentLink2Description: https://octopart.com:443/opatz8j6/c1?t=b8RlzpfQG-h9uOWAabMAiPJWoCTgAwquZzec_BkdV6ZjMU2OI4YyppNX09BT2fM0gpcDMTQrYtgvce6_TtfmK4XZa-h4SQxM8TKEKMrJJktc7O_kAaPT_h62tC27hsW5hQAKMoGbKBjHibz2blvr-fhN1RVl1yW8EvD465A9BJDSrY_kRU3crDNophsG2nTX2Be3i9H2X4Kl0o-rARNMZYxgtWRCQAP9XVS_fu0jqO5PbtSNR57rXOk02X4GKKjnzDeVifR_OIS0uZ1j_pAkmvXspyYvhGUJvwUxZqgyekwRIScv7vrk5hgDM9rgOsgWHAf34DWgZgApfn4NaTTf5ebtlEHCtjJg6ABKjJ4CBoMZf9D-5muRZyk3ZTspSwA1lzBPrFk&src-supplier=Texas+Instruments; ComponentLink3URL: https://sigma.octopart.com:443/49249646/technical_drawing/Texas-Instruments-TLV9064IDR.pdf?src-supplier=Texas+Instruments; ComponentLink3Description: https://sigma.octopart.com:443/49249646/technical_drawing/Texas-Instruments-TLV9064IDR.pdf?src-supplier=Texas+Instruments; ComponentLink4URL: https://datasheet.octopart.com:443/TLV9064IDR-Texas-Instruments-datasheet-101609303.pdf?src-supplier=Farnell; ComponentLink4Description: https://datasheet.octopart.com:443/TLV9064IDR-Texas-Instruments-datasheet-101609303.pdf?src-supplier=Farnell; ComponentLink5URL: https://datasheet.octopart.com:443/TLV9064IDR-Texas-Instruments-datasheet-160738807.pdf?src-supplier=LCSC; ComponentLink5Description: https://datasheet.octopart.com:443/TLV9064IDR-Texas-Instruments-datasheet-160738807.pdf?src-supplier=LCSC; ComponentLink6URL: https://datasheet.octopart.com:443/TLV9064IDR-Texas-Instruments-datasheet-159117845.pdf?src-supplier=LCSC; ComponentLink6Description: https://datasheet.octopart.com:443/TLV9064IDR-Texas-Instruments-datasheet-159117845.pdf?src-supplier=LCSC; ComponentLink7URL: http://sigma.octopart.com:80/reach_statement/Texas-Instruments-company-64.pdf?src-supplier=Compliance+Statements; ComponentLink7Description: http://sigma.octopart.com:80/reach_statement/Texas-Instruments-company-64.pdf?src-supplier=Compliance+Statements; ComponentLink8URL: http://sigma.octopart.com:80/conflict_mineral_statement/Texas-Instruments-company-63.pdf?src-supplier=Compliance+Statements; ComponentLink8Description: http://sigma.octopart.com:80/conflict_mineral_statement/Texas-Instruments-company-63.pdf?src-supplier=Compliance+Statements

## Sheet PLL.SchDoc
size Letter; DrawnBy: Titan Yuan; DocumentNumber: 3; SheetNumber: 3; SheetTotal: 7
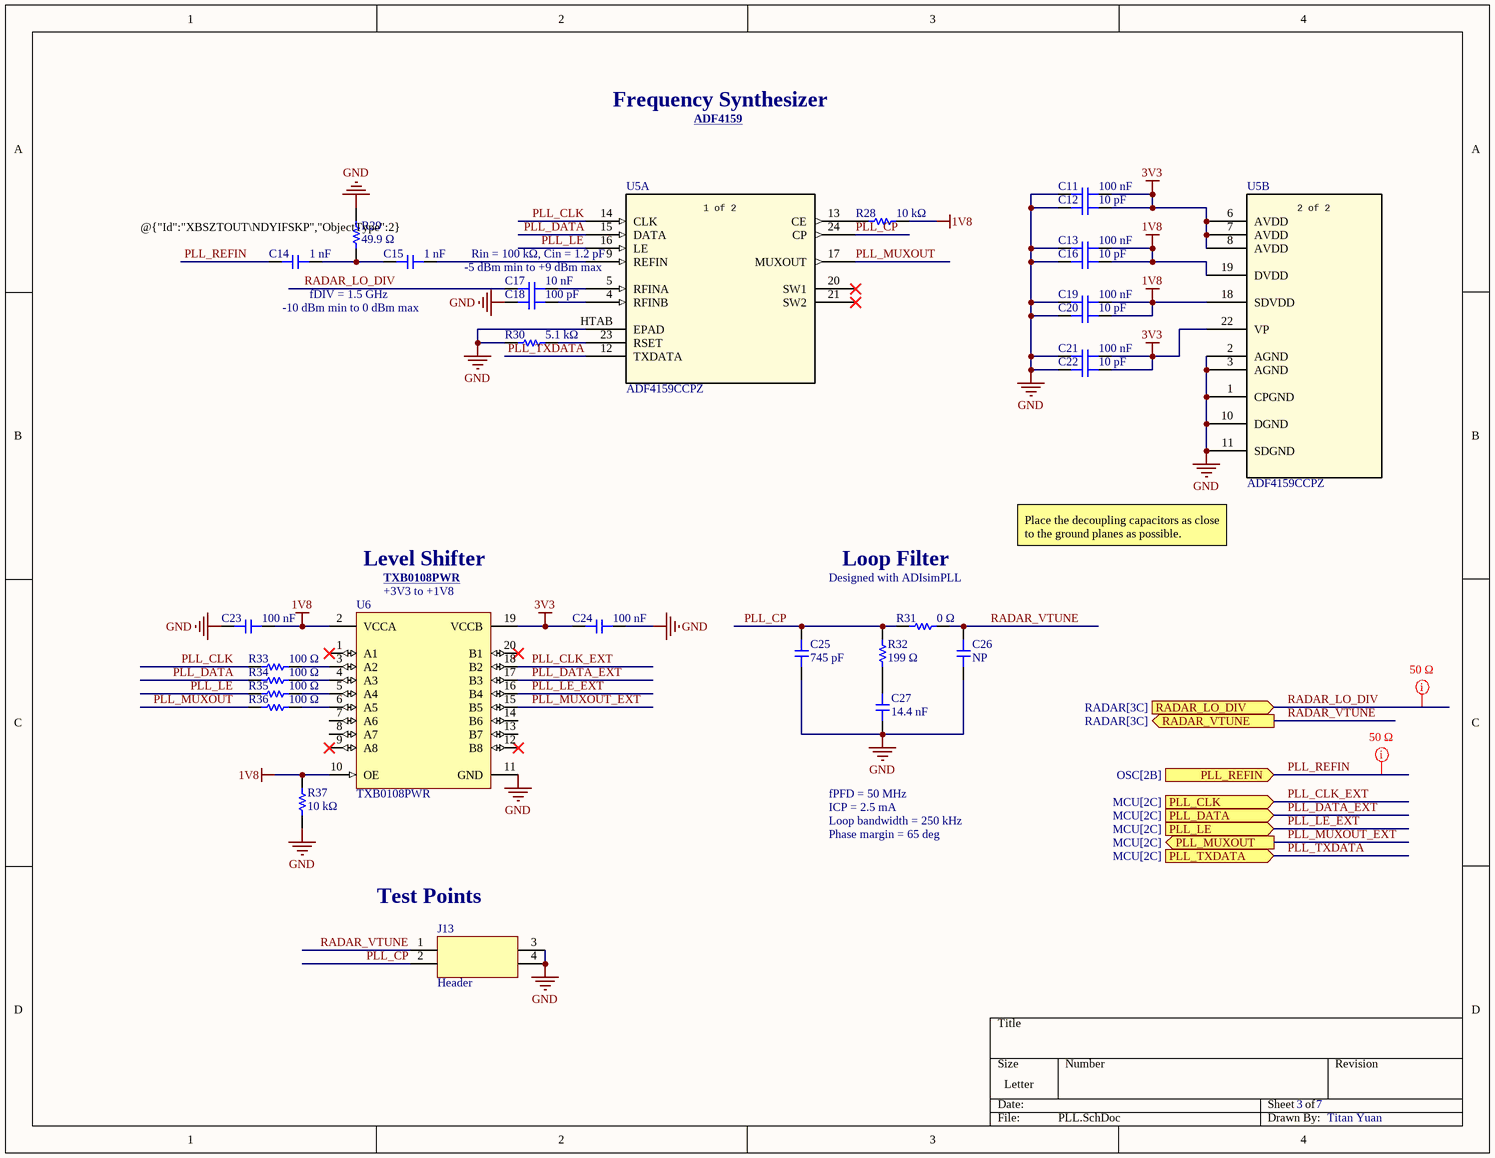
[diagram p2: PLL.SchDoc]

### Parts
C11  100 nF  [CAP_0402]
C12  10 pF  [CAP_0402]
C13  100 nF  [CAP_0402]
C14  1 nF  [CAP_0402]
C15  1 nF  [CAP_0402]
C16  10 pF  [CAP_0402]
C17  10 nF  [CAP_0402]
C18  100 pF  [CAP_0402]
C19  100 nF  [CAP_0402]
C20  10 pF  [CAP_0402]
C21  100 nF  [CAP_0402]
C22  10 pF  [CAP_0402]
C23  100 nF  [CAP_0402]
C24  100 nF  [CAP_0402]
C25  745 pF  [CAP_0805]
C26  NP  [CAP_0805]
C27  14.4 nF  [CAP_0805]
J13  Header  [CONN_2x2_2.54mm_PinHeader_Vertical]
R28  10 kΩ  [RES_0402]
R29  49.9 Ω  [RES_0603]
R30  5.1 kΩ  [RES_0402]
R31  0 Ω  [RES_0805]
R32  199 Ω  [RES_0805]
R33  100 Ω  [RES_0402]
R34  100 Ω  [RES_0402]
R35  100 Ω  [RES_0402]
R36  100 Ω  [RES_0402]
R37  10 kΩ  [RES_0402]
U5  ADF4159CCPZ  [CP_24_10_ADI]  (parts A,B of 2)
U6  TXB0108PWR  [TXB0108PWR]

### Ports
PLL_CLK (in, see MCU[2C]), PLL_DATA (in, see MCU[2C]), PLL_LE (in, see MCU[2C]), PLL_MUXOUT (out, see MCU[2C]), PLL_REFIN (in, see OSC[2B]), PLL_TXDATA (in, see MCU[2C]), RADAR_LO_DIV (in, see RADAR[3C]), RADAR_VTUNE (out, see RADAR[3C])

### Nets
1V8: C13.2 C16.2 C19.2 C20.2 C23.1 R28.2 R37.1 U5.18(SDVDD) U5.19(DVDD) U6.2(VCCA) U6.10(OE)
3V3: C11.2 C12.2 C21.2 C22.2 C24.2 U5.6(AVDD) U5.7(AVDD) U5.8(AVDD) U5.22(VP) U6.19(VCCB)  [project net AVDD]
GND: C11.1 C12.1 C13.1 C16.1 C18.2 C19.1 C20.1 C21.1 C22.1 C23.2 C24.1 C25.2 C26.2 C27.2 J13.3 J13.4 R29.1 R30.2 R37.2 U5.1(CPGND) U5.2(AGND) U5.3(AGND) U5.10(DGND) U5.11(SDGND) U5.HTAB(EPAD) U6.11(GND)
PLL_CLK: R33.2 U5.14(CLK)  [project net PLL_CLK_3]
PLL_CLK_EXT: U6.18(B2) ; port PLL_CLK  [project net PLL_CLK]
PLL_CP: C25.1 J13.2 R31.2 R32.1 U5.24(CP)  [project net PLL_CP_3]
PLL_DATA: R34.2 U5.15(DATA)  [project net PLL_DATA_3]
PLL_DATA_EXT: U6.17(B3) ; port PLL_DATA  [project net PLL_DATA]
PLL_LE: R35.2 U5.16(LE)  [project net PLL_LE_3]
PLL_LE_EXT: U6.16(B4) ; port PLL_LE  [project net PLL_LE]
PLL_MUXOUT: R36.2 U5.17(MUXOUT)  [project net PLL_MUXOUT_3]
PLL_MUXOUT_EXT: U6.15(B5) ; port PLL_MUXOUT  [project net PLL_MUXOUT]
PLL_REFIN: C14.2 ; port PLL_REFIN
PLL_TXDATA: U5.12(TXDATA) ; port PLL_TXDATA
RADAR_LO_DIV: C17.2 ; port RADAR_LO_DIV
RADAR_VTUNE: C26.1 J13.1 R31.1 ; port RADAR_VTUNE
NetC14_1: C14.1 C15.2 R29.2
NetC15_1: C15.1 U5.9(REFIN)
NetC17_1: C17.1 U5.5(RFINA)
NetC18_1: C18.1 U5.4(RFINB)
NetC27_1: C27.1 R32.2
NetR28_1: R28.1 U5.13(CE)
NetR30_1: R30.1 U5.23(RSET)
NetR33_1: R33.1 U6.3(A2)
NetR34_1: R34.1 U6.4(A3)
NetR35_1: R35.1 U6.5(A4)
NetR36_1: R36.1 U6.6(A5)

Not connected (* = marked no-connect by the designer): U5 20(SW1)* 21(SW2)*; U6 1(A1)* 7(A6) 8(A7) 9(A8)* 12(B8)* 13(B7) 14(B6) 20(B1)*

### Layout directives
net class 50 Ω: PLL_REFIN, RADAR_LO_DIV

### Notes on the sheet
- Frequency Synthesizer
- ADF4159 <https://www.analog.com/en/products/adf4159.html>
- @{"Id":"XBSZTOUT\NDYIFSKP","ObjectType":2} attenuates the clock to 1.8 Vptp.
- fDIV = 1.5 GHz
- -5 dBm min to +9 dBm max
- (near U5) Rin = 100 kΩ, Cin = 1.2 pF
- -10 dBm min to 0 dBm max
- Level Shifter
- Loop Filter
- Place the decoupling capacitors as close to the ground planes as possible.
- (near U6) +3V3 to +1V8
- (near U6) TXB0108PWR <https://www.ti.com/product/TXB0108>
- Designed with ADIsimPLL
- ICP = 2.5 mA
- fPFD = 50 MHz
- Loop bandwidth = 250 kHz
- Phase margin = 65 deg
- (near J13) Test Points
- (in symbol ADF4159CCPZ, part A) 1 of 2
- (in symbol ADF4159CCPZ, part B) 2 of 2